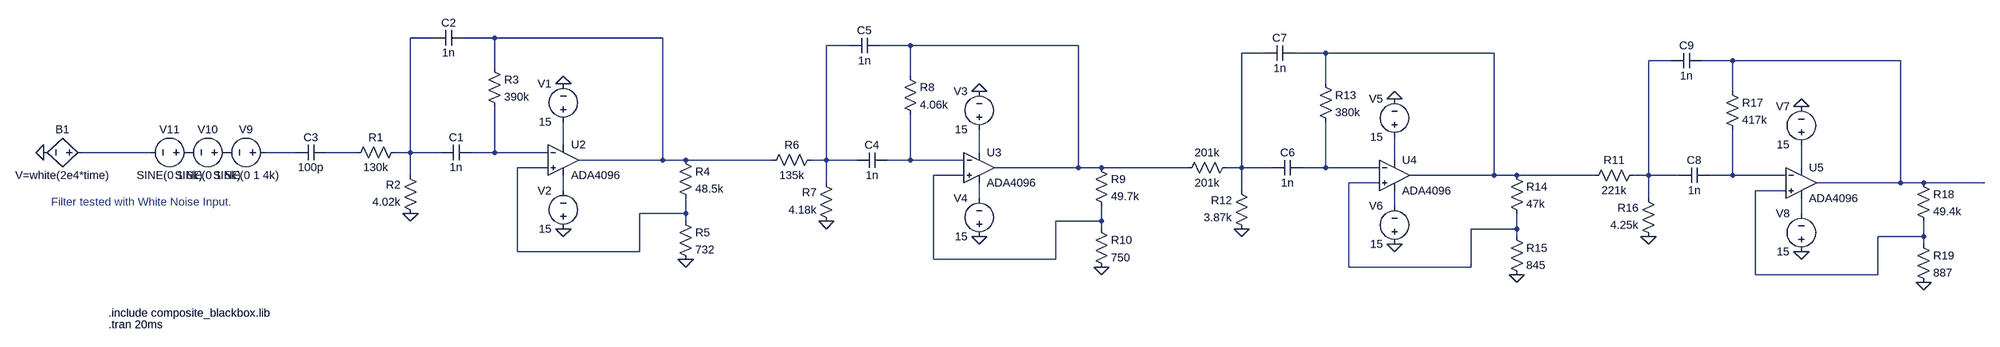
[diagram p0: schematic HackathonFinalSchem4kHz.asc]
HackathonFinalSchem4kHz.asc, the LTspice schematic file:
Version 4.1
SHEET 1 3748 680
WIRE 352 -16 304 -16
WIRE 480 -16 416 -16
WIRE 832 -16 480 -16
WIRE 1264 0 1216 0
WIRE 1392 0 1328 0
WIRE 1744 0 1392 0
WIRE 2160 16 2112 16
WIRE 2288 16 2224 16
WIRE 2640 16 2288 16
WIRE 3088 32 3040 32
WIRE 3216 32 3152 32
WIRE 3568 32 3216 32
WIRE 480 48 480 -16
WIRE 1392 64 1392 0
WIRE 2288 80 2288 16
WIRE 3216 96 3216 32
WIRE 624 208 624 160
WIRE -240 224 -384 224
WIRE 64 224 0 224
WIRE 192 224 128 224
WIRE 304 224 304 -16
WIRE 304 224 272 224
WIRE 368 224 304 224
WIRE 480 224 480 128
WIRE 480 224 432 224
WIRE 592 224 480 224
WIRE 1536 224 1536 176
WIRE 832 240 832 -16
WIRE 832 240 656 240
WIRE 880 240 832 240
WIRE 1104 240 880 240
WIRE 1216 240 1216 0
WIRE 1216 240 1184 240
WIRE 1280 240 1216 240
WIRE 1392 240 1392 144
WIRE 1392 240 1344 240
WIRE 1504 240 1392 240
WIRE 2432 240 2432 192
WIRE 592 256 528 256
WIRE 1744 256 1744 0
WIRE 1744 256 1568 256
WIRE 1792 256 1744 256
WIRE 2000 256 1792 256
WIRE 2112 256 2112 16
WIRE 2112 256 2080 256
WIRE 2176 256 2112 256
WIRE 2288 256 2288 160
WIRE 2288 256 2240 256
WIRE 2400 256 2288 256
WIRE 3360 256 3360 208
WIRE 304 272 304 224
WIRE 1504 272 1440 272
WIRE 2640 272 2640 16
WIRE 2640 272 2464 272
WIRE 2688 272 2640 272
WIRE 2928 272 2688 272
WIRE 3040 272 3040 32
WIRE 3040 272 3008 272
WIRE 3104 272 3040 272
WIRE 3216 272 3216 176
WIRE 3216 272 3168 272
WIRE 3328 272 3216 272
WIRE 1216 288 1216 240
WIRE 2400 288 2336 288
WIRE 3568 288 3568 32
WIRE 3568 288 3392 288
WIRE 3616 288 3568 288
WIRE 3744 288 3616 288
WIRE 624 304 624 272
WIRE 2112 304 2112 256
WIRE 3328 304 3264 304
WIRE 1536 320 1536 288
WIRE 3040 320 3040 272
WIRE 2432 336 2432 304
WIRE 880 352 880 320
WIRE 880 352 784 352
WIRE 3360 352 3360 320
WIRE 880 368 880 352
WIRE 1792 368 1792 336
WIRE 1792 368 1696 368
WIRE 1792 384 1792 368
WIRE 2688 384 2688 352
WIRE 2688 384 2592 384
WIRE 2688 400 2688 384
WIRE 3616 400 3616 368
WIRE 3616 400 3520 400
WIRE 3616 416 3616 400
WIRE 528 432 528 256
WIRE 784 432 784 352
WIRE 784 432 528 432
WIRE 1440 448 1440 272
WIRE 1696 448 1696 368
WIRE 1696 448 1440 448
WIRE 2336 464 2336 288
WIRE 2592 464 2592 384
WIRE 2592 464 2336 464
WIRE 3264 480 3264 304
WIRE 3520 480 3520 400
WIRE 3520 480 3264 480
FLAG 880 448 0
FLAG 304 352 0
FLAG 624 384 0
FLAG 624 80 0
FLAG 1792 464 0
FLAG 1216 368 0
FLAG 1536 400 0
FLAG 1536 96 0
FLAG 2688 480 0
FLAG 2112 384 0
FLAG 2432 416 0
FLAG 2432 112 0
FLAG 3616 496 0
FLAG 3040 400 0
FLAG 3360 432 0
FLAG 3360 128 0
FLAG -464 224 0
SYMBOL res 288 208 R90
WINDOW 0 0 56 VBottom 2
WINDOW 3 32 56 VTop 2
SYMATTR InstName R1
SYMATTR Value 130k
SYMBOL res 320 368 R180
WINDOW 0 36 76 Left 2
WINDOW 3 36 40 Left 2
SYMATTR InstName R2
SYMATTR Value 4.02k
SYMBOL cap 368 240 R270
WINDOW 0 32 32 VTop 2
WINDOW 3 0 32 VBottom 2
SYMATTR InstName C1
SYMATTR Value 1n
SYMBOL cap 352 0 R270
WINDOW 0 32 32 VTop 2
WINDOW 3 0 32 VBottom 2
SYMATTR InstName C2
SYMATTR Value 1n
SYMBOL res 464 32 R0
SYMATTR InstName R3
SYMATTR Value 390k
SYMBOL res 864 224 R0
SYMATTR InstName R4
SYMATTR Value 48.5k
SYMBOL res 864 352 R0
SYMATTR InstName R5
SYMATTR Value 732
SYMBOL voltage 624 176 R180
WINDOW 0 24 96 Left 2
WINDOW 3 24 16 Left 2
WINDOW 123 0 0 Left 0
WINDOW 39 0 0 Left 0
SYMATTR InstName V1
SYMATTR Value 15
SYMBOL voltage 624 400 R180
WINDOW 0 24 96 Left 2
WINDOW 3 24 16 Left 2
WINDOW 123 0 0 Left 0
WINDOW 39 0 0 Left 0
SYMATTR InstName V2
SYMATTR Value 15
SYMBOL OpAmps\\ADA4096 624 176 R0
SYMATTR InstName U2
SYMBOL cap 128 208 R90
WINDOW 0 0 32 VBottom 2
WINDOW 3 32 32 VTop 2
SYMATTR InstName C3
SYMATTR Value 100p
SYMBOL res 1200 224 R90
WINDOW 0 0 56 VBottom 2
WINDOW 3 32 56 VTop 2
SYMATTR InstName R6
SYMATTR Value 135k
SYMBOL res 1232 384 R180
WINDOW 0 36 76 Left 2
WINDOW 3 36 40 Left 2
SYMATTR InstName R7
SYMATTR Value 4.18k
SYMBOL cap 1280 256 R270
WINDOW 0 32 32 VTop 2
WINDOW 3 0 32 VBottom 2
SYMATTR InstName C4
SYMATTR Value 1n
SYMBOL cap 1264 16 R270
WINDOW 0 32 32 VTop 2
WINDOW 3 0 32 VBottom 2
SYMATTR InstName C5
SYMATTR Value 1n
SYMBOL res 1376 48 R0
SYMATTR InstName R8
SYMATTR Value 4.06k
SYMBOL res 1776 240 R0
SYMATTR InstName R9
SYMATTR Value 49.7k
SYMBOL res 1776 368 R0
SYMATTR InstName R10
SYMATTR Value 750
SYMBOL voltage 1536 192 R180
WINDOW 0 24 96 Left 2
WINDOW 3 24 16 Left 2
WINDOW 123 0 0 Left 0
WINDOW 39 0 0 Left 0
SYMATTR InstName V3
SYMATTR Value 15
SYMBOL voltage 1536 416 R180
WINDOW 0 24 96 Left 2
WINDOW 3 24 16 Left 2
WINDOW 123 0 0 Left 0
WINDOW 39 0 0 Left 0
SYMATTR InstName V4
SYMATTR Value 15
SYMBOL OpAmps\\ADA4096 1536 192 R0
SYMATTR InstName U3
SYMBOL res 2096 240 R90
WINDOW 0 0 56 VBottom 2
WINDOW 3 32 56 VTop 2
SYMATTR InstName 201k
SYMATTR Value 201k
SYMBOL res 2128 400 R180
WINDOW 0 36 76 Left 2
WINDOW 3 36 40 Left 2
SYMATTR InstName R12
SYMATTR Value 3.87k
SYMBOL cap 2176 272 R270
WINDOW 0 32 32 VTop 2
WINDOW 3 0 32 VBottom 2
SYMATTR InstName C6
SYMATTR Value 1n
SYMBOL cap 2160 32 R270
WINDOW 0 32 32 VTop 2
WINDOW 3 0 32 VBottom 2
SYMATTR InstName C7
SYMATTR Value 1n
SYMBOL res 2272 64 R0
SYMATTR InstName R13
SYMATTR Value 380k
SYMBOL res 2672 256 R0
SYMATTR InstName R14
SYMATTR Value 47k
SYMBOL res 2672 384 R0
SYMATTR InstName R15
SYMATTR Value 845
SYMBOL voltage 2432 208 R180
WINDOW 0 24 96 Left 2
WINDOW 3 24 16 Left 2
WINDOW 123 0 0 Left 0
WINDOW 39 0 0 Left 0
SYMATTR InstName V5
SYMATTR Value 15
SYMBOL voltage 2432 432 R180
WINDOW 0 24 96 Left 2
WINDOW 3 24 16 Left 2
WINDOW 123 0 0 Left 0
WINDOW 39 0 0 Left 0
SYMATTR InstName V6
SYMATTR Value 15
SYMBOL OpAmps\\ADA4096 2432 208 R0
SYMATTR InstName U4
SYMBOL res 3024 256 R90
WINDOW 0 0 56 VBottom 2
WINDOW 3 32 56 VTop 2
SYMATTR InstName R11
SYMATTR Value 221k
SYMBOL res 3056 416 R180
WINDOW 0 36 76 Left 2
WINDOW 3 36 40 Left 2
SYMATTR InstName R16
SYMATTR Value 4.25k
SYMBOL cap 3104 288 R270
WINDOW 0 32 32 VTop 2
WINDOW 3 0 32 VBottom 2
SYMATTR InstName C8
SYMATTR Value 1n
SYMBOL cap 3088 48 R270
WINDOW 0 32 32 VTop 2
WINDOW 3 0 32 VBottom 2
SYMATTR InstName C9
SYMATTR Value 1n
SYMBOL res 3200 80 R0
SYMATTR InstName R17
SYMATTR Value 417k
SYMBOL res 3600 272 R0
SYMATTR InstName R18
SYMATTR Value 49.4k
SYMBOL res 3600 400 R0
SYMATTR InstName R19
SYMATTR Value 887
SYMBOL voltage 3360 224 R180
WINDOW 0 24 96 Left 2
WINDOW 3 24 16 Left 2
WINDOW 123 0 0 Left 0
WINDOW 39 0 0 Left 0
SYMATTR InstName V7
SYMATTR Value 15
SYMBOL voltage 3360 448 R180
WINDOW 0 24 96 Left 2
WINDOW 3 24 16 Left 2
WINDOW 123 0 0 Left 0
WINDOW 39 0 0 Left 0
SYMATTR InstName V8
SYMATTR Value 15
SYMBOL OpAmps\\ADA4096 3360 224 R0
SYMATTR InstName U5
SYMBOL voltage 16 224 R90
WINDOW 0 -32 56 VBottom 2
WINDOW 3 32 56 VTop 2
WINDOW 123 0 0 Left 0
WINDOW 39 0 0 Left 0
SYMATTR InstName V9
SYMATTR Value SINE(0 1 4k)
SYMBOL voltage -64 224 R90
WINDOW 0 -32 56 VBottom 2
WINDOW 3 32 56 VTop 2
WINDOW 123 0 0 Left 0
WINDOW 39 0 0 Left 0
SYMATTR InstName V10
SYMATTR Value SINE(0 1 5k)
SYMBOL voltage -144 224 R90
WINDOW 0 -32 56 VBottom 2
WINDOW 3 32 56 VTop 2
WINDOW 123 0 0 Left 0
WINDOW 39 0 0 Left 0
SYMATTR InstName V11
SYMATTR Value SINE(0 1 6k)
SYMBOL bv -368 224 R90
WINDOW 0 -32 56 VBottom 2
WINDOW 3 32 56 VTop 2
SYMATTR InstName B1
SYMATTR Value V=white(2e4*time)
TEXT -328 560 Left 2 !.include composite_blackbox.lib
TEXT -328 584 Left 2 !.tran 20ms
TEXT -448 328 Left 2 ;Filter tested with White Noise Input.

The netlist it stands for:
* HackathonFinalSchem4kHz.asc
R1 N001 N012 130k
R2 0 N001 4.02k
C1 N001 N013 1n
C2 N001 N002 1n
R3 N002 N013 390k
R4 N002 N017 48.5k
R5 N017 0 732
V1 N009 0 15
V2 0 N023 15
X§U2 N017 N013 N009 N023 N002 ADA4096  ; pins In+ In- V+ V- OUT
C3 N012 N011 100p
R6 N003 N002 135k
R7 0 N003 4.18k
C4 N003 N015 1n
C5 N003 N004 1n
R8 N004 N015 4.06k
R9 N004 N020 49.7k
R10 N020 0 750
V3 N014 0 15
V4 0 N025 15
X§U3 N020 N015 N014 N025 N004 ADA4096  ; pins In+ In- V+ V- OUT
R§201k N005 N004 201k
R12 0 N005 3.87k
C6 N005 N018 1n
C7 N005 N006 1n
R13 N006 N018 380k
R14 N006 N022 47k
R15 N022 0 845
V5 N016 0 15
V6 0 N026 15
X§U4 N022 N018 N016 N026 N006 ADA4096  ; pins In+ In- V+ V- OUT
R11 N007 N006 221k
R16 0 N007 4.25k
C8 N007 N021 1n
C9 N007 N008 1n
R17 N008 N021 417k
R18 N008 N024 49.4k
R19 N024 0 887
V7 N019 0 15
V8 0 N027 15
X§U5 N024 N021 N019 N027 N008 ADA4096  ; pins In+ In- V+ V- OUT
V9 N011 P001 SINE(0 1 4k)
V10 P001 P002 SINE(0 1 5k)
V11 P002 N010 SINE(0 1 6k)
B1 N010 0 V=white(2e4*time)
.include composite_blackbox.lib
.tran 20ms
* Filter tested with White Noise Input.
.backanno
.end